# Altium project Gastroscopy-Tool-Interface.PrjPcb
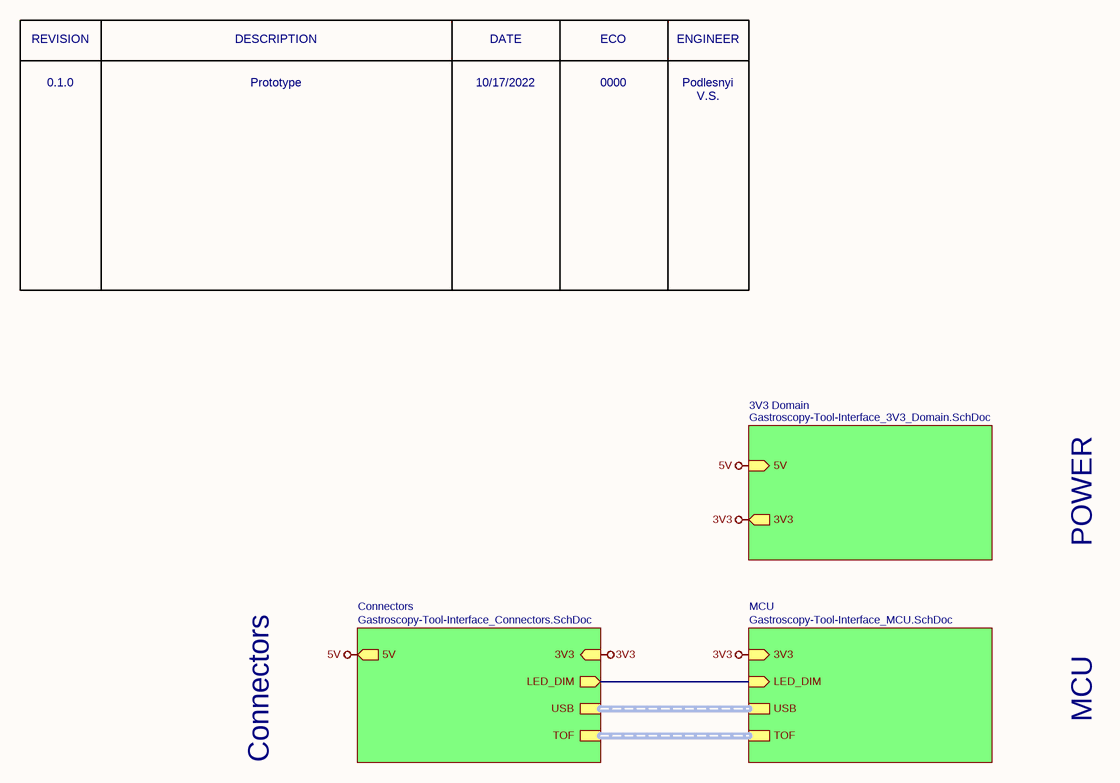
[diagram p0: Gastroscopy-Tool-Interface_Overview.SchDoc]
GlobalAddress1: nab. reki Karpovki, d. 5/3E; GlobalAddress2: Saint-Petersburg, 197022; GlobalAddress3: Ph: +7 (911) 701-51-99; GlobalCompanyName: MRobot, LCC; GlobalDocumentNumberDrawingASM: 0000-0000; GlobalDocumentNumberDrawingPCB: 0000-0000; GlobalDocumentNumberPCB: 0000-0000; GlobalDocumentNumberSCH: 0000-0000; GlobalDocumentSubtitle: Tool Interface; GlobalDocumentTitle: Gastroscopy Tool Interface; GlobalEngineer: Podlesnyi Vasilii; GlobalJiraKey: GSTRTOOLINT; GlobalProjectTitle: Gastroscopy Tool Interface; GlobalRevisionBOM: 0.1.0; GlobalRevisionPCB: 0.1.0; GlobalRevisionSCH: 0.1.0
4 sheets, 31 parts. Net scope: hierarchical (ports join the sheet entries above them; power ports are global).
Board file: Gastroscopy-Tool-Interface.PcbDoc
Sheets:
  Gastroscopy-Tool-Interface_Overview.SchDoc
    MCU = Gastroscopy-Tool-Interface_MCU.SchDoc
    Connectors = Gastroscopy-Tool-Interface_Connectors.SchDoc
    3V3 Domain = Gastroscopy-Tool-Interface_3V3_Domain.SchDoc

## Sheet Gastroscopy-Tool-Interface_Overview.SchDoc: Overview
size 279 x 215 mm; Date: not used; ApprovedBy: not used; CheckedBy: not used; Author: not used; CompanyName: MRobot, LCC; DrawnBy: not used; Engineer: Podlesnyi Vasilii; Organization: not used; Address1: nab. reki Karpovki, d. 5/3E; Address2: Saint-Petersburg, 197022; Address3: Ph: +7 (911) 701-51-99; Address4: not used; DocumentNumber: 0000-0000; Revision: 0.1.0; SheetNumber: 1; SheetTotal: 4; ProjectTitle: Gastroscopy Tool Interface; Time: not used; ImagePath: not used; Application_BuildNumber: not used

### Sub-sheets
3V3 Domain = Gastroscopy-Tool-Interface_3V3_Domain.SchDoc: 3V3 (out), 5V (in)
Connectors = Gastroscopy-Tool-Interface_Connectors.SchDoc: USB (harness USB), TOF (harness TOF), 5V (out), 3V3 (in), LED_DIM (out)
MCU = Gastroscopy-Tool-Interface_MCU.SchDoc: 3V3 (in), USB (harness USB), TOF (harness TOF), LED_DIM (in)

### Nets
3V3: sheet MCU/3V3, sheet Connectors/3V3, sheet 3V3 Domain/3V3
5V: sheet Connectors/5V, sheet 3V3 Domain/5V
LED_DIM: sheet MCU/LED_DIM, sheet Connectors/LED_DIM

### Buses and harness runs
harness sheet Connectors/TOF = sheet MCU/TOF
harness sheet Connectors/USB = sheet MCU/USB

### Notes on the sheet
- REVISION
- DESCRIPTION
- DATE
- ECO
- ENGINEER
- 0.1.0
- Prototype
- 10/17/2022
- 0000
- Podlesnyi V.S.
- POWER
- MCU
- Connectors
- Title:
- Date:
- Size A
- Project:
- Number:
- Time:
- Sheet
- Revision
- of
- Engineer:
- www.mrobots.ru <http://mrobots.ru/>
- File:

## Sheet Gastroscopy-Tool-Interface_MCU.SchDoc: MCU
size 279 x 215 mm; Date: not used; ApprovedBy: not used; CheckedBy: not used; Author: not used; CompanyName: MRobot, LCC; DrawnBy: not used; Engineer: Podlesnyi Vasilii; Organization: not used; Address1: nab. reki Karpovki, d. 5/3E; Address2: Saint-Petersburg, 197022; Address3: Ph: +7 (911) 701-51-99; Address4: not used; DocumentNumber: 0000-0000; Revision: 0.1.0; SheetNumber: 4; SheetTotal: 4; ProjectTitle: Gastroscopy Tool Interface; Time: not used; ImagePath: not used; Application_BuildNumber: not used
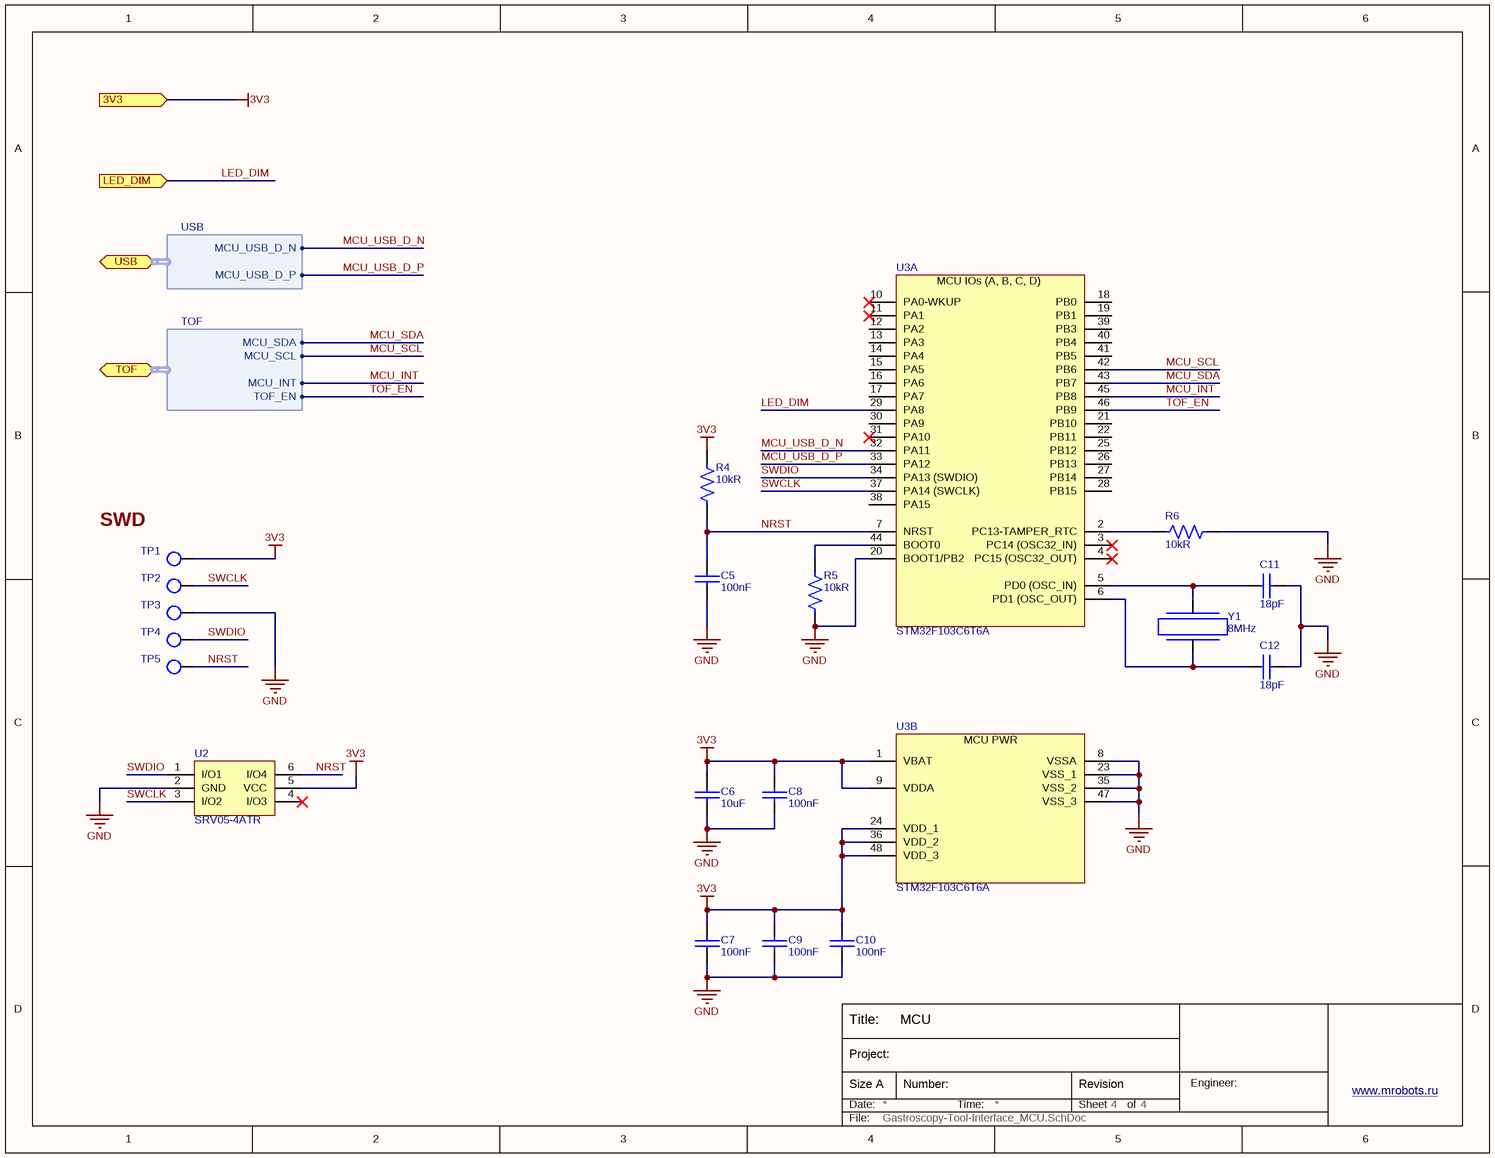
[diagram p1: Gastroscopy-Tool-Interface_MCU.SchDoc]

### Parts
C5  100nF  [CAP_0603]
C6  10uF  [CAP_0805]
C7  100nF  [CAP_0603]
C8  100nF  [CAP_0603]
C9  100nF  [CAP_0603]
C10  100nF  [CAP_0603]
C11  18pF  [CAP_0603]
C12  18pF  [CAP_0603]
R4  10kR  [RES_0603]
R5  10kR  [RES_0603]
R6  10kR  [RES_0603]
TP1  TEST_POINT_SMT  [TEST_POINT_SMT]  (value not drawn)  (no BOM)
TP2  TEST_POINT_SMT  [TEST_POINT_SMT]  (value not drawn)  (no BOM)
TP3  TEST_POINT_SMT  [TEST_POINT_SMT]  (value not drawn)  (no BOM)
TP4  TEST_POINT_SMT  [TEST_POINT_SMT]  (value not drawn)  (no BOM)
TP5  TEST_POINT_SMT  [TEST_POINT_SMT]  (value not drawn)  (no BOM)
U2  SRV05-4ATR  [SOT-23-6]
U3  STM32F103C6T6A  [LQFP48]  (parts A,B of 2)
Y1  8MHz  [HC-49/US]

### Ports
3V3 (in), LED_DIM (in), TOF (bidir, harness TOF), USB (bidir, harness USB)

### Harnesses
USB: MCU_USB_D_N, MCU_USB_D_P
TOF: MCU_SDA, MCU_SCL, MCU_INT, TOF_EN

### Nets
3V3: C6.2 C7.1 C8.1 C9.1 C10.1 R4.1 TP1.1 U2.5(VCC) U3.1(VBAT) U3.9(VDDA) U3.24(VDD_1) U3.36(VDD_2) U3.48(VDD_3) ; port 3V3
GND: C5.2 C6.1 C7.2 C8.2 C9.2 C10.2 C11.2 C12.2 R5.1 R6.1 TP3.1 U2.2(GND) U3.8(VSSA) U3.20(BOOT1/PB2) U3.23(VSS_1) U3.35(VSS_2) U3.47(VSS_3)
LED_DIM: U3.29(PA8) ; port LED_DIM
MCU_INT: U3.45(PB8) ; port TOF.MCU_INT
MCU_SCL: U3.42(PB6) ; port TOF.MCU_SCL
MCU_SDA: U3.43(PB7) ; port TOF.MCU_SDA
MCU_USB_D_N: U3.32(PA11) ; port USB.MCU_USB_D_N
MCU_USB_D_P: U3.33(PA12) ; port USB.MCU_USB_D_P
NRST: C5.1 R4.2 TP5.1 U2.6(I/O4) U3.7(NRST)
SWCLK: TP2.1 U2.3(I/O2) U3.37(PA14_(SWCLK))
SWDIO: TP4.1 U2.1(I/O1) U3.34(PA13_(SWDIO))
TOF_EN: U3.46(PB9) ; port TOF.TOF_EN
NetC11_1: C11.1 U3.5(PD0_(OSC_IN)) Y1.2
NetC12_1: C12.1 U3.6(PD1_(OSC_OUT)) Y1.1
NetR5_2: R5.2 U3.44(BOOT0)
NetR6_2: R6.2 U3.2(PC13-TAMPER_RTC)

Not connected (* = marked no-connect by the designer): U2 4(I/O3)*; U3 3(PC14_(OSC32_IN))* 4(PC15_(OSC32_OUT))* 10(PA0-WKUP)* 11(PA1)* 12(PA2) 13(PA3) 14(PA4) 15(PA5) 16(PA6) 17(PA7) 18(PB0) 19(PB1) 21(PB10) 22(PB11) 25(PB12) 26(PB13) 27(PB14) 28(PB15) 30(PA9) 31(PA10)* 38(PA15) 39(PB3) 40(PB4) 41(PB5)

### Notes on the sheet
- SWD
- Title:
- Date:
- Size A
- Project:
- Number:
- Time:
- Sheet
- Revision
- of
- Engineer:
- www.mrobots.ru <http://mrobots.ru/>
- File:
- (in symbol STM32F103C6T6A, part A) MCU IOs (A, B, C, D)
- (in symbol STM32F103C6T6A, part B) MCU PWR

### Library data of the parts
C5 C7-C10 = CL10B104KB8NNNL: CAP CER 0.1UF 50V X7R 0603; Manufacturer 1: Samsung; Tolerance: 10%; Supplier 1: Digi-Key; Manufacturer Part Number 1: CL10B104KB8NNNL; RoHS: Yes; Category: Ceramic Capacitors; Stock 1: 2348404; Pricing 1: 15000=0,00532, 30000=0,00506 (USD); Mount: Surface Mount; Case/Package: 0603; Min Operating Temperature: -55°C; Max Operating Temperature: 125°C; Capacitance: 100nF; Packaging: Tape and Reel; Package Quantity: 15000; Voltage Rating: 50V; Dielectric: X7R; Voltage Rating (DC): 50V; Series: CL; Construction: Flat; Length: 1.6mm; Width: 0.031inch; Height: 0.8mm; Thickness: 0.035inch; Depth: 0.8mm; Radiation Hardening: No; RoHS Compliant: Yes; ComponentLink1URL: https://datasheet.ciiva.com/26838/getdatasheetpartid-357523-26838415.pdf?src-supplier=Verical; ComponentLink1Description: https://datasheet.ciiva.com/26838/getdatasheetpartid-357523-26838415.pdf?src-supplier=Verical; ComponentLink2URL: https://datasheet.ciiva.com/25741/cl10b104kb8nnnl-25741341.pdf?src-supplier=Digi-Key; ComponentLink2Description: https://datasheet.ciiva.com/25741/cl10b104kb8nnnl-25741341.pdf?src-supplier=Digi-Key; Supplier Part Number 1: 1276-CL10B104KB8NNNLTR-ND
C6 = CL21B106KOQNNNE: CAP CER 10UF 16V X7R 0805; Manufacturer: Samsung; Tolerance: 10%; Supplier 1: Avnet; Manufacturer Part Number: CL21B106KOQNNNE; RoHS: Yes; Category: Ceramic Capacitors; Stock 1: 1089000; Pricing 1: 2000=0,02892, 4000=0,02851, 8000=0,02768, 12000=0,02707, 16000=0,02603 (USD); Mount: Surface Mount; Case/Package: 0805; Case Code (Metric): 2012; Case Code (Imperial): 0805; Contact Plating: Tin; Min Operating Temperature: -55°C; Max Operating Temperature: 125°C; Packaging: Tape and Reel; Capacitance: 10uF; Voltage Rating: 16V; Package Quantity: 1; Dielectric: X7R; Series: CL; Construction: Flat; Voltage: 16V; Length: 2mm; Width: 0.049inch; Height: 1.25mm; Thickness: 0.055inch; Depth: 1.25mm; Radiation Hardening: No; RoHS Compliant: Yes; ComponentLink1URL: https://datasheet.ciiva.com/25794/cl21b106koqnnne-25794472.pdf?src-supplier=Digi-Key; ComponentLink1Description: https://datasheet.ciiva.com/25794/cl21b106koqnnne-25794472.pdf?src-supplier=Digi-Key; ComponentLink2URL: https://datasheet.ciiva.com/16428/cl21b106koqnnne-16428887.pdf?src-supplier=Future+Electronics; ComponentLink2Description: https://datasheet.ciiva.com/16428/cl21b106koqnnne-16428887.pdf?src-supplier=Future+Electronics; ComponentLink3URL: https://datasheet.ciiva.com/26920/getdatasheetpartid-355170-26920201.pdf?src-supplier=Verical; ComponentLink3Description: https://datasheet.ciiva.com/26920/getdatasheetpartid-355170-26920201.pdf?src-supplier=Verical; Supplier Part Number 1: CL21B106KOQNNNE
C11 C12 = C0603C180J5GACAUTO: CAP CER 18PF 50V C0G/NP0 0603; Manufacturer: KEMET; Dielectric Material: Ceramic; Tolerance: 5%; Dielectric: C0G; Supplier 1: Arrow Electronics; Manufacturer Part Number: C0603C180J5GACAUTO; RoHS: Yes; Category: Ceramic Capacitors; Stock 1: 13801; Pricing 1: 1=0.10780, 10=0.04490, 25=0.04440, 100=0.03270, 250=0.03140, 500=0.02510, 1000=0.01950, 3000=0.01910, 6000=0.01510 (USD); Case/Package: 0603; Min Operating Temperature: -55°C; Max Operating Temperature: 125°C; Packaging: Tape and Reel; Capacitance: 18pF; Voltage Rating (DC): 50V; Length: 1.6mm; Depth: 0.8mm; Lead Free: Lead Free; RoHS Compliant: Yes; ComponentLink1URL: http://www.farnell.com/datasheets/2747367.pdf?src-supplier=Farnell; ComponentLink1Description: http://www.farnell.com/datasheets/2747367.pdf?src-supplier=Farnell; ComponentLink2URL: https://api.kemet.com/component-edge/download/datasheet/C0603C180J5GACAUTO.pdf?src-supplier=Digi-Key; ComponentLink2Description: https://api.kemet.com/component-edge/download/datasheet/C0603C180J5GACAUTO.pdf?src-supplier=Digi-Key; ComponentLink3URL: http://www.farnell.com/datasheets/2747367.pdf?src-supplier=Newark; ComponentLink3Description: http://www.farnell.com/datasheets/2747367.pdf?src-supplier=Newark; ComponentLink4URL: http://www.farnell.com/datasheets/2747367.pdf?src-supplier=Element14; ComponentLink4Description: http://www.farnell.com/datasheets/2747367.pdf?src-supplier=Element14; Supplier Part Number 1: C0603C180J5GACAUTO; Manufacturer 1: KEMET; Manufacturer Part Number 1: C0603C180J5GACAUTO
R4-R6 = RC0603FR-0710KL: RES 10K OHM 1% 1/10W 0603; Manufacturer 1: Yageo; Voltage Rating (DC): 50V; Temperature Coefficient: 100ppm/°C; Power Rating: 100mW; Voltage Rating: 75V; Supplier 1: Arrow Electronics; RoHS: Yes; Category: Chip SMD Resistors; Stock 1: 4950000; Pricing 1: 5000=0,00240 (USD); Case/Package: 0603; Number of Pins: 2; Case Code (Imperial): 0603; Case Code (Metric): 1608; Weight: 7.1E-05oz; Size Code: 0603; Min Operating Temperature: -55°C; Max Operating Temperature: 155°C; Packaging: Tape and Reel; Resistance: 10kR; Tolerance: 1%; Resistor Type: Thick Film; Termination: SMD/SMT; Features: Moisture Resistant; Series: RC; Max Power Dissipation: 100mW; Number of Terminations: 2; Resistance Tolerance: 1%; Construction: Rectangular; Length: 1.6mm; Width: 0.8mm; Height: 0.45mm; Depth: 0.8mm; Lead Pitch: 0.3mm; REACH SVHC: Unknown; Lead Free: Lead Free; Military Standard: Not; RoHS Compliant: Yes; ComponentLink1URL: https://datasheet.ciiva.com/7660/38590-7660789.pdf?src-supplier=Element14; ComponentLink1Description: https://datasheet.ciiva.com/7660/38590-7660789.pdf?src-supplier=Element14; ComponentLink2URL: https://datasheet.ciiva.com/7983/443971-7983596.pdf?src-supplier=Element14; ComponentLink2Description: https://datasheet.ciiva.com/7983/443971-7983596.pdf?src-supplier=Element14; ComponentLink3URL: https://datasheet.ciiva.com/22747/443971-22747519.pdf?src-supplier=Element14; ComponentLink3Description: https://datasheet.ciiva.com/22747/443971-22747519.pdf?src-supplier=Element14; ComponentLink4URL: https://datasheet.ciiva.com/46440/1868787-46440891.pdf?src-supplier=Element14; ComponentLink4Description: https://datasheet.ciiva.com/46440/1868787-46440891.pdf?src-supplier=Element14; ComponentLink5URL: https://datasheet.ciiva.com/7746/1738695-7746239.pdf?src-supplier=Element14; ComponentLink5Description: https://datasheet.ciiva.com/7746/1738695-7746239.pdf?src-supplier=Element14; Supplier Part Number 1: RC0603FR-0710KL; Manufacturer Part Number 1: RC0603FR-0710KL
TP1-TP5 = TEST_POINT_SMT: STM TEST POINT
U2 = SRV05-4ATR: TVS DIODE 5VWM 17.5VC SOT23-6; Manufacturer 1: Sangdest Microelectronics; Supplier 1: Digi-Key; Manufacturer Part Number 1: SRV05-4ATR; RoHS: No; Category: TVS Diodes; Stock 1: 31500; Pricing 1: 1=0,45000, 10=0,36700, 100=0,24990, 500=0,18744, 1000=0,14058 (USD); Supplier Part Number 1: 1655-1653-1-ND
U3 = STM32F103C6T6A: IC MCU 32BIT 32KB FLASH 48LQFP; Manufacturer 1: STMicroelectronics; Number of Timers/Counters: 3; Max Supply Voltage: 3.6V; Frequency: 72MHz; Interface: I2C,SPI,USART; RAM Size: 10KB; Max Power Dissipation: 363mW; Number of I/Os: 37; Min Supply Voltage: 2V; Oscillator Type: Internal; Data Bus Width: 32b; Watchdog Timer: Yes; Peripherals: POR,PWM,WDT,DMA,Temp Sensor,I2C; Core Architecture: ARM; Number of ADC Channels: 10; Number of SPI Channels: 1; Supplier 1: Newark; RoHS: Yes; Category: Microcontrollers; Pricing 1: 1=6,56000, 10=5,90000, 1500=5,90000 (USD); Case/Package: LQFP; Number of Pins: 48; Weight: 0.006409oz; Min Operating Temperature: -40°C; Max Operating Temperature: 85°C; Package Quantity: 1500; Packaging: Tray; Max Frequency: 72MHz; Number of Programmable I/O: 37; Memory Type: FLASH; Memory Size: 32KB; Series: STM32F103C6; Number of I2C Channels: 1; Address Bus Width: 32b; Length: 7mm; Width: 7mm; Height: 1.4mm; Radiation Hardening: No; Lead Free: Lead Free; REACH SVHC: No SVHC; RoHS Compliant: Yes; ComponentLink1URL: https://datasheet.ciiva.com/15122/getdatasheetpartid-69879-15122075.pdf?src-supplier=Verical; ComponentLink1Description: https://datasheet.ciiva.com/15122/getdatasheetpartid-69879-15122075.pdf?src-supplier=Verical; ComponentLink2URL: https://datasheet.ciiva.com/14100/pustm-arm-microcont-stm32f103-en-14100507.pdf?src-supplier=Distrelec; ComponentLink2Description: https://datasheet.ciiva.com/14100/pustm-arm-microcont-stm32f103-en-14100507.pdf?src-supplier=Distrelec; Supplier Part Number 1: 57P1219; Manufacturer Part Number 1: STM32F103C6T6A
Y1 = ATS080B-E: CRYSTAL 8.0000MHZ 18PF TH; Manufacturer 1: CTS; Frequency Tolerance: 30ppm; ESR (Equivalent Series Resistance): 60R; Frequency Stability: 50ppm; Supplier 1: Avnet; RoHS: Yes; Category: Crystals; Stock 1: 4510; Pricing 1: 1000=0.18120, 1200=0.17880, 2200=0.17040, 5000=0.13800, 10000=0.12150, 50000=0.10956, 100000=0.10707 (USD); Mount: Through Hole; Number of Pins: 2; Contact Plating: Copper,Tin,Silver; Min Operating Temperature: -40°C; Max Operating Temperature: 85°C; Package Quantity: 100; Frequency: 8MHz; Load Capacitance: 18pF; Packaging: Bulk; Tolerance: 30ppm; Termination: Radial; Series: ATS; Length: 0.427inch; Width: 0.177inch; Height: 0.145inch; RoHS Compliant: Yes; ComponentLink1URL: https://datasheet.ciiva.com/859/008-0309-0-859649.pdf?src-supplier=Digi-Key; ComponentLink1Description: https://datasheet.ciiva.com/859/008-0309-0-859649.pdf?src-supplier=Digi-Key; ComponentLink2URL: https://datasheet.ciiva.com/3176/008-0309-0-3176342.pdf?src-supplier=Avnet; ComponentLink2Description: https://datasheet.ciiva.com/3176/008-0309-0-3176342.pdf?src-supplier=Avnet; ComponentLink3URL: https://datasheet.ciiva.com/4945/008-0309-0-32667-4945355.pdf?src-supplier=Mouser; ComponentLink3Description: https://datasheet.ciiva.com/4945/008-0309-0-32667-4945355.pdf?src-supplier=Mouser; Supplier Part Number 1: ATS080B-E; Manufacturer Part Number 1: ATS080B-E

## Sheet Gastroscopy-Tool-Interface_Connectors.SchDoc: Connectors
size 279 x 215 mm; Date: not used; ApprovedBy: not used; CheckedBy: not used; Author: not used; CompanyName: MRobot, LCC; DrawnBy: not used; Engineer: Podlesnyi Vasilii; Organization: not used; Address1: nab. reki Karpovki, d. 5/3E; Address2: Saint-Petersburg, 197022; Address3: Ph: +7 (911) 701-51-99; Address4: not used; DocumentNumber: 0000-0000; Revision: 0.1.0; SheetNumber: 2; SheetTotal: 4; ProjectTitle: Gastroscopy Tool Interface; Time: not used; ImagePath: not used; Application_BuildNumber: not used
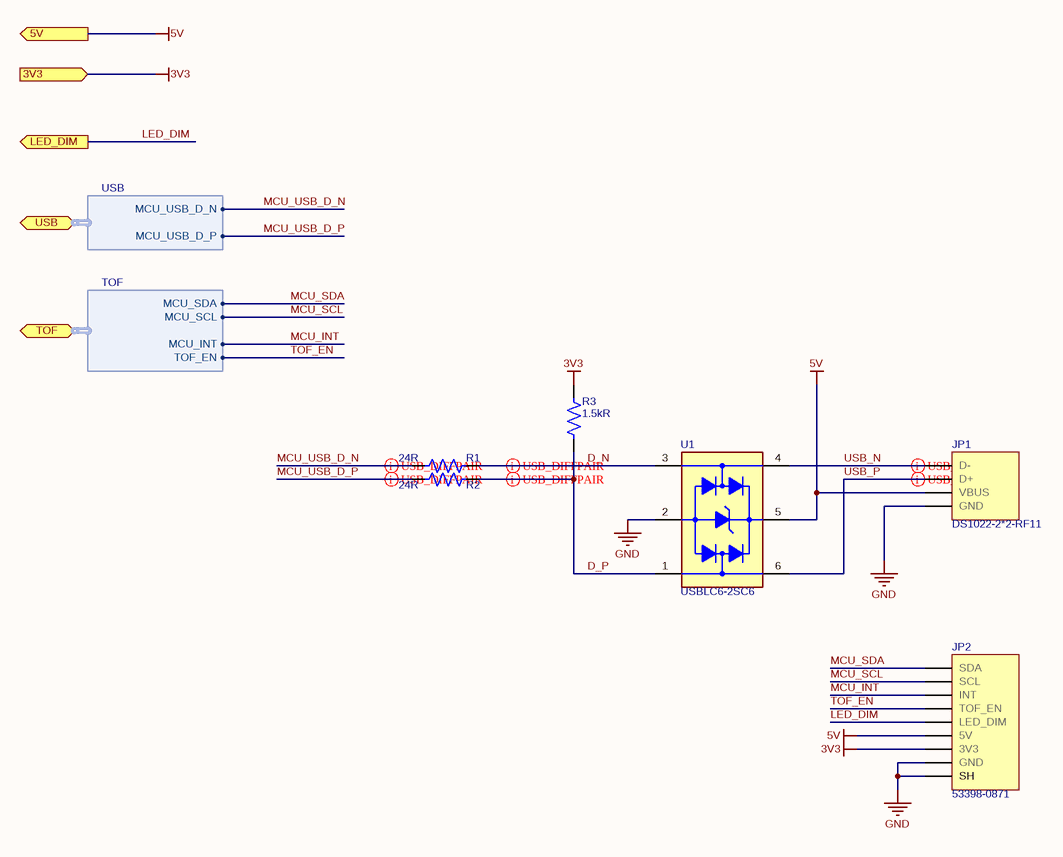
[diagram p2: Gastroscopy-Tool-Interface_Connectors.SchDoc]

### Parts
JP1  DS1022-2*2-RF11  [DS1022-2*2-RF11]
JP2  53398-0871  [PICOBLADE_533980871]
R1  24R  [RES_0603]
R2  24R  [RES_0603]
R3  1.5kR  [RES_0603]
U1  USBLC6-2SC6  [SOT-23-6]

### Ports
3V3 (in), 5V (out), LED_DIM (out), TOF (bidir, harness TOF), USB (bidir, harness USB)

### Harnesses
USB: MCU_USB_D_N, MCU_USB_D_P
TOF: MCU_SDA, MCU_SCL, MCU_INT, TOF_EN

### Nets
3V3: JP2.7 R3.1 ; port 3V3
5V: JP1.3 JP2.6 U1.5(VBUS) ; port 5V
GND: JP1.4 JP2.8 JP2.SH U1.2(GND)
D_N: R1.2 U1.3(I/O_2)
D_P: R2.2 R3.2 U1.1(I/O_1)
LED_DIM: JP2.5 ; port LED_DIM
MCU_INT: JP2.3 ; port TOF.MCU_INT
MCU_SCL: JP2.2 ; port TOF.MCU_SCL
MCU_SDA: JP2.1 ; port TOF.MCU_SDA
MCU_USB_D_N: R1.1 ; port USB.MCU_USB_D_N
MCU_USB_D_P: R2.1 ; port USB.MCU_USB_D_P
TOF_EN: JP2.4 ; port TOF.TOF_EN
USB_N: JP1.1 U1.4(I/O_3)
USB_P: JP1.2 U1.6(I/O_4)

### Layout directives
differential pair; differential pair class USB_DIFFPAIR: D_N, D_P, MCU_USB_D_N, MCU_USB_D_P, USB_N, USB_P

### Notes on the sheet
- Title:
- Date:
- Size A
- Project:
- Number:
- Time:
- Sheet
- Revision
- of
- Engineer:
- www.mrobots.ru <http://mrobots.ru/>
- File:

### Library data of the parts
JP1 = DS1022-2*2-RF11: CONN HEADER VERT 2POS 2.54MM; Manufacturer 1: Connfly electronic (Zhenqin); Contact_1: D-; Contact_2: D+; Contact_3: VBUS; Contact_4: GND; Manufacturer Part Number 1: DS1022-2*2-RF11
JP2 = 533980871: CONN HEADER SMD 8POS 1.25MM; Manufacturer 1: Molex; Contact_1: SDA; Contact_2: SCL; Contact_3: INT; Contact_4: TOF_EN; Contact_5: LED_DIM; Contact_6: 5V; Contact_7: 3V3; Contact_8: GND; Supplier 1: RSComponents; Manufacturer Part Number 1: 53398-0871; RoHS: Yes; Category: Headers and Wire Housings; Stock 1: 21360; Pricing 1: 100=0,79800, 375=0,68200, 1500=0,56800, 3000=0,45600 (GBP); Supplier Part Number 1: 6563030P
R1 R2 = RC0603FR-0724RL: RES 24 OHM 1% 1/10W 0603; Manufacturer 1: Yageo; Power Rating: 100mW; Voltage Rating (DC): 50V; Temperature Coefficient: 100ppm/°C; Working Voltage: 75V; Supplier 1: Arrow Electronics; RoHS: Yes; Category: Chip SMD Resistors; Stock 1: 90000; Pricing 1: 5000=0,00190, 125000=0,00160 (USD); Case/Package: 0603; Case Code (Imperial): 0603; Case Code (Metric): 1608; Min Operating Temperature: -55°C; Max Operating Temperature: 155°C; Tolerance: 1%; Resistance: 24R; Packaging: Tape and Reel; Voltage Rating: 50V; Termination: SMD/SMT; Number of Terminations: 2; Features: Moisture Resistant; Series: RC; Max Power Dissipation: 100mW; Lead Free: Lead Free; RoHS Compliant: Yes; Supplier Part Number 1: RC0603FR-0724RL; Manufacturer Part Number 1: RC0603FR-0724RL
R3 = RC0603FR-071K5L: RES 1.5K OHM 1% 1/10W 0603; Manufacturer 1: Yageo; Voltage Rating (DC): 50V; Temperature Coefficient: 100ppm/°C; Power Rating: 100mW; Supplier 1: Arrow Electronics; RoHS: Yes; Category: Chip SMD Resistors; Stock 1: 15000; Pricing 1: 5000=0,00350 (USD); Case/Package: 0603; Number of Pins: 2; Case Code (Metric): 1608; Case Code (Imperial): 0603; Size Code: 0603; Min Operating Temperature: -55°C; Max Operating Temperature: 155°C; Tolerance: 1%; Packaging: Tape and Reel; Resistance: 1.5kR; Resistor Type: Thick Film; Voltage Rating: 50V; Package Quantity: 1; Number of Terminations: 2; Termination: SMD/SMT; Max Power Dissipation: 100mW; Features: Moisture Resistant; Series: RC; Resistance Tolerance: 1%; Construction: Rectangular; Length: 0.063inch; Width: 0.031inch; Height: 0.022inch; Depth: 0.8mm; REACH SVHC: No SVHC; Lead Free: Lead Free; Military Standard: Not; RoHS Compliant: Yes; ComponentLink1URL: https://datasheet.ciiva.com/46440/1868787-46440895.pdf?src-supplier=Element14; ComponentLink1Description: https://datasheet.ciiva.com/46440/1868787-46440895.pdf?src-supplier=Element14; ComponentLink2URL: https://datasheet.ciiva.com/2454/pyu-r-int-thick-7-2454514.pdf?src-supplier=Digi-Key; ComponentLink2Description: https://datasheet.ciiva.com/2454/pyu-r-int-thick-7-2454514.pdf?src-supplier=Digi-Key; ComponentLink3URL: https://datasheet.ciiva.com/2454/pyu-r-int-thick-7-2454515.pdf?src-supplier=Digi-Key; ComponentLink3Description: https://datasheet.ciiva.com/2454/pyu-r-int-thick-7-2454515.pdf?src-supplier=Digi-Key; ComponentLink4URL: https://datasheet.ciiva.com/2454/pyu-r-int-thick-7-2454513.pdf?src-supplier=Digi-Key; ComponentLink4Description: https://datasheet.ciiva.com/2454/pyu-r-int-thick-7-2454513.pdf?src-supplier=Digi-Key; Supplier Part Number 1: RC0603FR-071K5L; Manufacturer Part Number 1: RC0603FR-071K5L
U1 = USBLC6-2SC6: TVS DIODE 5.25VWM 17VC SOT23-6; Manufacturer 1: STMicroelectronics; Direction: Unidirectional,Bidirectional; Capacitance: 3.5pF; Operating Supply Voltage: 1.1V; Number of Channels: 2; Breakdown Voltage: 6V; Clamping Voltage: 17V; Reverse Standoff Voltage: 5.25V; Power Line Protection: Yes; Test Current: 1mA; Max Reverse Leakage Current: 150nA; Peak Pulse Current: 5A; Element Configuration: Dual; Data Rate: 480Mbps; Number of Elements: 1; Working Voltage: 5V; Supplier 1: Digi-Key; RoHS: Yes; Category: TVS Diodes; Pricing 1: 1=0.63000, 10=0.54200, 100=0.40440, 500=0.31774, 1000=0.24553 (USD); Mount: Surface Mount; Case/Package: SOT-23; Number of Pins: 6; Contact Plating: Tin,Matte; Min Operating Temperature: -40°C; Max Operating Temperature: 125°C; Packaging: Tape and Reel; Package Quantity: 3000; Termination: SMD/SMT; Number of Bidirectional Channels: 2; Min Breakdown Voltage: 6V; ESD Protection: Yes; Leakage Current: 150nA; Series: USB; Reverse Breakdown Voltage: 6V; Polarity: Unidirectional,Bidirectional; Max Breakdown Voltage: 6V; Clamping Voltage-Max: 17V; Length: 3.05mm; Width: 1.75mm; Height: 1.3mm; Depth: 1.75mm; Radiation Hardening: No; REACH SVHC: No SVHC; Lead Free: Lead Free; RoHS Compliant: Yes; ComponentLink1URL: https://datasheet.ciiva.com/1268/1690354-1268384.pdf?src-supplier=Element14; ComponentLink1Description: https://datasheet.ciiva.com/1268/1690354-1268384.pdf?src-supplier=Element14; ComponentLink2URL: https://datasheet.ciiva.com/4508/cd00050750-113117-4508433.pdf?src-supplier=Mouser; ComponentLink2Description: https://datasheet.ciiva.com/4508/cd00050750-113117-4508433.pdf?src-supplier=Mouser; ComponentLink3URL: https://datasheet.ciiva.com/15143/getdatasheetpartid-148465-15143789.pdf?src-supplier=Verical; ComponentLink3Description: https://datasheet.ciiva.com/15143/getdatasheetpartid-148465-15143789.pdf?src-supplier=Verical; ComponentLink4URL: https://datasheet.ciiva.com/16200/cd00050750-16200026.pdf?src-supplier=Future+Electronics; ComponentLink4Description: https://datasheet.ciiva.com/16200/cd00050750-16200026.pdf?src-supplier=Future+Electronics; ComponentLink5URL: https://datasheet.ciiva.com/41444/001184109-da-01-en-ic-esd-protecti-usblc6-2sc6-sot-23-6-stm-41444156.pdf?src-supplier=Conrad; ComponentLink5Description: https://datasheet.ciiva.com/41444/001184109-da-01-en-ic-esd-protecti-usblc6-2sc6-sot-23-6-stm-41444156.pdf?src-supplier=Conrad; Supplier Part Number 1: 497-5235-6-ND; Manufacturer Part Number 1: USBLC6-2SC6

## Sheet Gastroscopy-Tool-Interface_3V3_Domain.SchDoc: 3V3 Domain
size 279 x 215 mm; Date: not used; ApprovedBy: not used; CheckedBy: not used; Author: not used; CompanyName: MRobot, LCC; DrawnBy: not used; Engineer: Podlesnyi Vasilii; Organization: not used; Address1: nab. reki Karpovki, d. 5/3E; Address2: Saint-Petersburg, 197022; Address3: Ph: +7 (911) 701-51-99; Address4: not used; DocumentNumber: 0000-0000; Revision: 0.1.0; SheetNumber: 3; SheetTotal: 4; ProjectTitle: Gastroscopy Tool Interface; Time: not used; ImagePath: not used; Application_BuildNumber: not used
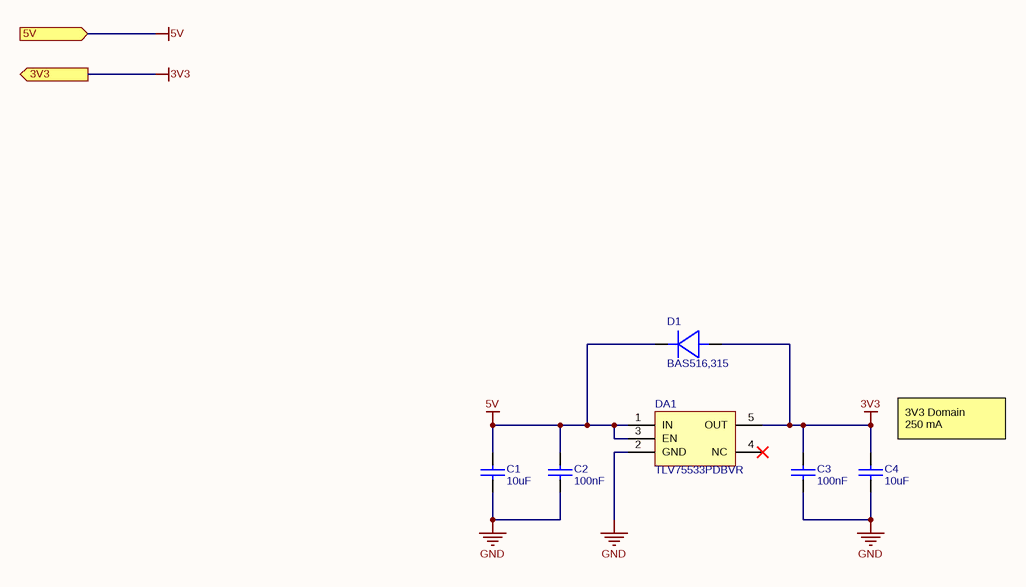
[diagram p3: Gastroscopy-Tool-Interface_3V3_Domain.SchDoc]

### Parts
C1  10uF  [CAP_0805]
C2  100nF  [CAP_0603]
C3  100nF  [CAP_0603]
C4  10uF  [CAP_0805]
D1  BAS516,315  [SOD-523]
DA1  TLV75533PDBVR  [SOT-23-5]

### Ports
3V3 (out), 5V (in)

### Nets
3V3: C3.1 C4.2 D1.2(A) DA1.5(OUT) ; port 3V3
5V: C1.2 C2.1 D1.1(C) DA1.1(IN) DA1.3(EN) ; port 5V
GND: C1.1 C2.2 C3.2 C4.1 DA1.2(GND)

Not connected (* = marked no-connect by the designer): DA1 4(NC)*

### Notes on the sheet
- (near C4) 3V3 Domain
  250 mA
- Title:
- Date:
- Size A
- Project:
- Number:
- Time:
- Sheet
- Revision
- of
- Engineer:
- www.mrobots.ru <http://mrobots.ru/>
- File:

### Library data of the parts
C1 C4 = CL21B106KOQNNNE: as C6 on sheet Gastroscopy-Tool-Interface_MCU; Supplier 1: Avnet; Manufacturer Part Number: CL21B106KOQNNNE; RoHS: Yes; Category: Ceramic Capacitors; Stock 1: 1089000; Pricing 1: 2000=0,02892, 4000=0,02851, 8000=0,02768, 12000=0,02707, 16000=0,02603 (USD); Mount: Surface Mount; Case/Package: 0805; Case Code (Metric): 2012; Case Code (Imperial): 0805; Contact Plating: Tin; Min Operating Temperature: -55°C; Max Operating Temperature: 125°C; Packaging: Tape and Reel; Capacitance: 10uF; Voltage Rating: 16V; Package Quantity: 1; Dielectric: X7R; Series: CL; Construction: Flat; Voltage: 16V; Length: 2mm; Width: 0.049inch; Height: 1.25mm; Thickness: 0.055inch; Depth: 1.25mm; Radiation Hardening: No; RoHS Compliant: Yes; ComponentLink1URL: https://datasheet.ciiva.com/25794/cl21b106koqnnne-25794472.pdf?src-supplier=Digi-Key; ComponentLink1Description: https://datasheet.ciiva.com/25794/cl21b106koqnnne-25794472.pdf?src-supplier=Digi-Key; ComponentLink2URL: https://datasheet.ciiva.com/16428/cl21b106koqnnne-16428887.pdf?src-supplier=Future+Electronics; ComponentLink2Description: https://datasheet.ciiva.com/16428/cl21b106koqnnne-16428887.pdf?src-supplier=Future+Electronics; ComponentLink3URL: https://datasheet.ciiva.com/26920/getdatasheetpartid-355170-26920201.pdf?src-supplier=Verical; ComponentLink3Description: https://datasheet.ciiva.com/26920/getdatasheetpartid-355170-26920201.pdf?src-supplier=Verical; Supplier Part Number 1: CL21B106KOQNNNE
C2 C3 = CL10B104KB8NNNL: as C5 on sheet Gastroscopy-Tool-Interface_MCU; Supplier 1: Digi-Key; Manufacturer Part Number 1: CL10B104KB8NNNL; RoHS: Yes; Category: Ceramic Capacitors; Stock 1: 2348404; Pricing 1: 15000=0,00532, 30000=0,00506 (USD); Mount: Surface Mount; Case/Package: 0603; Min Operating Temperature: -55°C; Max Operating Temperature: 125°C; Capacitance: 100nF; Packaging: Tape and Reel; Package Quantity: 15000; Voltage Rating: 50V; Dielectric: X7R; Voltage Rating (DC): 50V; Series: CL; Construction: Flat; Length: 1.6mm; Width: 0.031inch; Height: 0.8mm; Thickness: 0.035inch; Depth: 0.8mm; Radiation Hardening: No; RoHS Compliant: Yes; ComponentLink1URL: https://datasheet.ciiva.com/26838/getdatasheetpartid-357523-26838415.pdf?src-supplier=Verical; ComponentLink1Description: https://datasheet.ciiva.com/26838/getdatasheetpartid-357523-26838415.pdf?src-supplier=Verical; ComponentLink2URL: https://datasheet.ciiva.com/25741/cl10b104kb8nnnl-25741341.pdf?src-supplier=Digi-Key; ComponentLink2Description: https://datasheet.ciiva.com/25741/cl10b104kb8nnnl-25741341.pdf?src-supplier=Digi-Key; Supplier Part Number 1: 1276-CL10B104KB8NNNLTR-ND
D1 = BAS516,315: DIODE GEN PURP 100V 250MA SOD523; Manufacturer 1: Nexperia; Supplier 1: Avnet; Manufacturer Part Number 1: BAS516,315; RoHS: Yes; Category: Rectifier Diodes; Pricing 1: 48000=0,02889, 64000=0,02803, 112000=0,02716, 240000=0,02630, 480000=0,02543, 2400000=0,02457, 4800000=0,02370 (USD); RoHS Compliant: Yes; Supplier Part Number 1: BAS516,315
DA1 = TLV75533PDBVR: IC REG LINEAR 3.3V 500MA SOT23-5; Manufacturer 1: Texas Instruments; Output Type: Fixed; Output Configuration: Positive; Number of Regulators: 1; Max Input Voltage: 5.5V; Dropout Voltage: 238mV; Quiescent Current: 31uA; Power Supply Rejection Ratio (PSRR): 52dB; Supplier 1: Mouser; RoHS: Yes; Category: Voltage Regulators - Linear; Stock 1: 90; Pricing 1: 1=0,46000, 10=0,39400, 50=0,39400, 100=0,27300, 1000=0,17900, 10000=0,16200 (USD); Mount: Surface Mount; Case/Package: SOT-23-5; Min Operating Temperature: -40°C; Max Operating Temperature: 125°C; Packaging: Cut Tape; Min Output Voltage: 3.3V; Max Output Voltage: 3.3V; Output Current: 500mA; RoHS Compliant: Yes; ComponentLink1URL: http://www.ti.com/lit/ds/symlink/tlv755p.pdf?src-supplier=Digi-Key; ComponentLink1Description: http://www.ti.com/lit/ds/symlink/tlv755p.pdf?src-supplier=Digi-Key; ComponentLink2URL: http://www.ti.com/general/docs/suppproductinfo.tsp?distId=10&amp;gotoUrl=http%3A%2F%2Fwww.ti.com%2Flit%2Fgpn%2Ftlv755p&src-supplier=Digi-Key; ComponentLink2Description: http://www.ti.com/general/docs/suppproductinfo.tsp?distId=10&amp;gotoUrl=http%3A%2F%2Fwww.ti.com%2Flit%2Fgpn%2Ftlv755p&src-supplier=Digi-Key; Supplier Part Number 1: 595-TLV75533PDBVR; Manufacturer Part Number 1: TLV75533PDBVR

## Nets that join several sheets
3V3: Gastroscopy-Tool-Interface_MCU (13 pins), Gastroscopy-Tool-Interface_Connectors (JP2.7 R3.1), Gastroscopy-Tool-Interface_3V3_Domain (C3.1 C4.2 D1.2 DA1.5)
5V: Gastroscopy-Tool-Interface_Connectors (JP1.3 JP2.6 U1.5), Gastroscopy-Tool-Interface_3V3_Domain (5 pins)
GND: Gastroscopy-Tool-Interface_MCU (17 pins), Gastroscopy-Tool-Interface_Connectors (JP1.4 JP2.8 JP2.SH U1.2), Gastroscopy-Tool-Interface_3V3_Domain (5 pins)
LED_DIM: Gastroscopy-Tool-Interface_MCU (U3.29), Gastroscopy-Tool-Interface_Connectors (JP2.5)
MCU_INT: Gastroscopy-Tool-Interface_MCU (U3.45), Gastroscopy-Tool-Interface_Connectors (JP2.3)
MCU_SCL: Gastroscopy-Tool-Interface_MCU (U3.42), Gastroscopy-Tool-Interface_Connectors (JP2.2)
MCU_SDA: Gastroscopy-Tool-Interface_MCU (U3.43), Gastroscopy-Tool-Interface_Connectors (JP2.1)
MCU_USB_D_N: Gastroscopy-Tool-Interface_MCU (U3.32), Gastroscopy-Tool-Interface_Connectors (R1.1)
MCU_USB_D_P: Gastroscopy-Tool-Interface_MCU (U3.33), Gastroscopy-Tool-Interface_Connectors (R2.1)
TOF_EN: Gastroscopy-Tool-Interface_MCU (U3.46), Gastroscopy-Tool-Interface_Connectors (JP2.4)